# EAGLE design sidedriver (EAGLE 7.1.0)
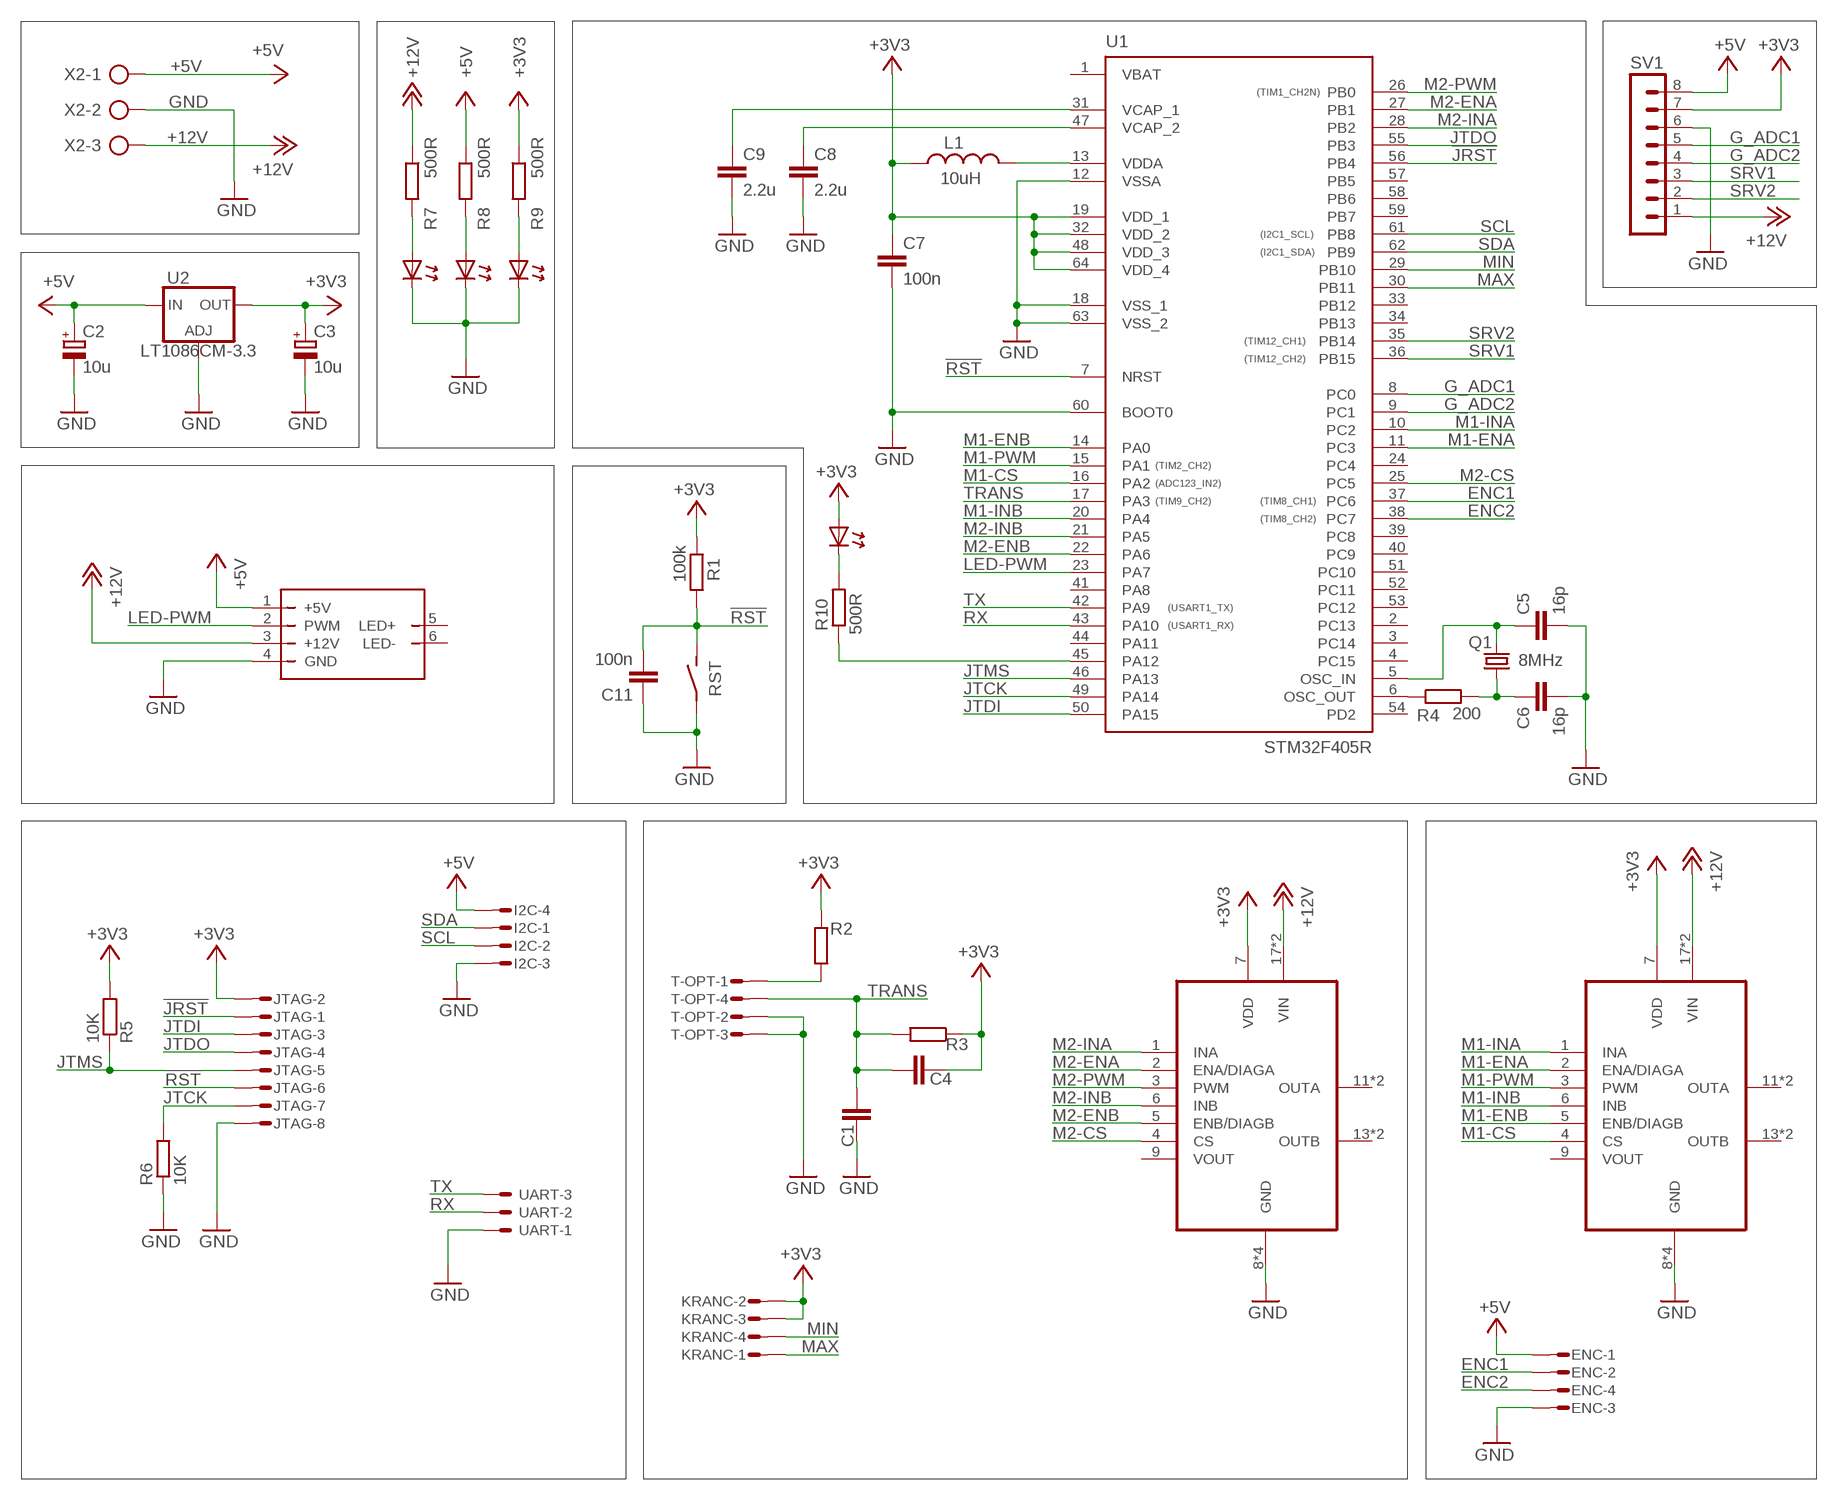
[diagram p0: schematic, sheet 1]

## Parts
C1  C-EUC0603  [C0603]
C2  10u  CPOL-EUSMCA  [SMC_A]
C3  10u  CPOL-EUSMCA  [SMC_A]
C4  C-EUC0603  [C0603]
C5  16p  C-EUC0603  [C0603]
C6  16p  C-EUC0603  [C0603]
C7  100n  C-EUC0603  [C0603]
C8  2.2u  C-EUC0603  [C0603]
C9  2.2u  C-EUC0603  [C0603]
C11  100n  C-EUC0603  [C0603]
ENC  MICROMATCH-4  [MICROMATCH-4]
I2C  MICROMATCH-4  [MICROMATCH-4]
JTAG  MICROMATCH-8  [MICROMATCH-8]
KRANC  MICROMATCH-4  [MICROMATCH-4]
L1  10uH  L  [L0805]
Q1  8MHz  CRYSTAL12SMX  [12SMX]
R1  100k  R-EU_R0603  [R0603]
R2  R-EU_R0603  [R0603]
R3  R-EU_R0603  [R0603]
R4  200  R-EU_R0603  [R0603]
R5  10K  R-EU_R0603  [R0603]
R6  10K  R-EU_R0603  [R0603]
R7  500R  R-EU_R0603  [R0603]
R8  500R  R-EU_R0603  [R0603]
R9  500R  R-EU_R0603  [R0603]
R10  500R  R-EU_R0603  [R0603]
RST  TACT_SWITCH  [SWITCH]
SV1  MA08-1  [MA08-1]
T-OPT  MICROMATCH-4  [MICROMATCH-4]
U1  STM32F405R  [TQFP64]
U2  LT1086CM-3.3  LD117AD2MTR  [D2PACK]
U$2  LEDD1  [LEDD1]
U$3  POLOLU-1451  [POLOLU-1451]
U$4  POLOLU-1451  [POLOLU-1451]
U$6  LED0603  [D0603]
U$7  LED0603  [D0603]
U$8  LED0603  [D0603]
U$9  LED0603  [D0603]
UART  C-GRID-03-70543  [70543-03]
X2  AK500/3  [AK500/3]

## Nets
!JRST: JTAG.1 U1.56(PB4)
!RST: C11.2 JTAG.6 R1.2 RST.2(S) RST.4(S) U1.7(NRST)
+3V3: C3.+ C4.1 C7.1 JTAG.2 KRANC.2 KRANC.3 L1.1 R1.1 R2.1 R3.1 R5.2 R9.1 SV1.7 U1.19(VDD_1) U1.32(VDD_2) U1.48(VDD_3) U1.64(VDD_4) U2.2(OUT) U$3.7(VDD) U$4.7(VDD) U$9.1(A)
+5V: C2.+ ENC.1 I2C.4 R8.1 SV1.8 U2.3(IN) U$2.1(+5V) X2.1
+12V: R7.1 SV1.1 U$2.3(+12V) U$3.17(VIN) U$3.18(VIN) U$4.17(VIN) U$4.18(VIN) X2.3
ENC1: ENC.2 U1.37(PC6)
ENC2: ENC.4 U1.38(PC7)
G_ADC1: SV1.5 U1.8(PC0)
G_ADC2: SV1.4 U1.9(PC1)
GND: C1.1 C2.- C3.- C5.2 C6.2 C7.2 C8.2 C9.2 C11.1 ENC.3 I2C.3 JTAG.8 R6.1 RST.1(P) RST.3(P) SV1.6 T-OPT.2 T-OPT.3 U1.12(VSSA) U1.18(VSS_1) U1.60(BOOT0) U1.63(VSS_2) U2.1(ADJ) U$2.4(GND) U$3.8(GND) U$3.10(GND) U$3.15(GND) U$3.16(GND) U$4.8(GND) U$4.10(GND) U$4.15(GND) U$4.16(GND) U$6.2(C) U$7.2(C) U$8.2(C) UART.1 X2.2
JTCK: JTAG.7 R6.2 U1.49(PA14)
JTDI: JTAG.3 U1.50(PA15)
JTDO: JTAG.4 U1.55(PB3)
JTMS: JTAG.5 R5.1 U1.46(PA13)
LED-PWM: U1.23(PA7) U$2.2(PWM)
M1-CS: U1.16(PA2) U$4.4(CS)
M1-ENA: U1.11(PC3) U$4.2(ENA/DIAGA)
M1-ENB: U1.14(PA0) U$4.5(ENB/DIAGB)
M1-INA: U1.10(PC2) U$4.1(INA)
M1-INB: U1.20(PA4) U$4.6(INB)
M1-PWM: U1.15(PA1) U$4.3(PWM)
M2-CS: U1.25(PC5) U$3.4(CS)
M2-ENA: U1.27(PB1) U$3.2(ENA/DIAGA)
M2-ENB: U1.22(PA6) U$3.5(ENB/DIAGB)
M2-INA: U1.28(PB2) U$3.1(INA)
M2-INB: U1.21(PA5) U$3.6(INB)
M2-PWM: U1.26(PB0) U$3.3(PWM)
MAX: KRANC.1 U1.30(PB11)
MIN: KRANC.4 U1.29(PB10)
N$1: R2.2 T-OPT.1
N$4: C6.1 Q1.1 R4.2
N$5: C5.1 Q1.3 U1.5(OSC_IN)
N$8: R7.2 U$6.1(A)
N$9: R8.2 U$7.1(A)
N$10: R9.2 U$8.1(A)
N$11: R10.2 U$9.2(C)
N$12: R10.1 U1.45(PA12)
N$20: L1.2 U1.13(VDDA)
N$22: R4.1 U1.6(OSC_OUT)
N$23: C8.1 U1.47(VCAP_2)
N$24: C9.1 U1.31(VCAP_1)
RX: U1.43(PA10) UART.2
SCL: I2C.2 U1.61(PB8)
SDA: I2C.1 U1.62(PB9)
SRV1: SV1.3 U1.36(PB15)
SRV2: SV1.2 U1.35(PB14)
TRANS: C1.2 C4.2 R3.2 T-OPT.4 U1.17(PA3)
TX: U1.42(PA9) UART.3
Unconnected: U1.1(VBAT) U1.2(PC13) U1.3(PC14) U1.4(PC15) U1.24(PC4) U1.33(PB12) U1.34(PB13) U1.39(PC8) U1.40(PC9) U1.41(PA8) U1.44(PA11) U1.51(PC10) U1.52(PC11) U1.53(PC12) U1.54(PD2) U1.57(PB5) U1.58(PB6) U1.59(PB7) U$2.5(LED+) U$2.6(LED-) U$3.9(VOUT) U$3.11(OUTA) U$3.12(OUTA) U$3.13(OUTB) U$3.14(OUTB) U$4.9(VOUT) U$4.11(OUTA) U$4.12(OUTA) U$4.13(OUTB) U$4.14(OUTB)

## Notes on the sheet
- (TIM1_CH2N)
- (I2C1_SCL)
- (I2C1_SDA)
- (TIM12_CH1)
- (TIM12_CH2)
- (TIM2_CH2)
- (ADC123_IN2)
- (TIM9_CH2) | (TIM8_CH1)
- (TIM8_CH2)
- (USART1_TX)
- (USART1_RX)

## Library data of the parts
C1 C4-C9 C11 = rcl:C-EU: CAPACITOR, European symbol
C2 C3 = rcl:CPOL-EU: POLARIZED CAPACITOR, European symbol
ENC I2C KRANC T-OPT = con-maritex:MICROMATCH-4: MicroMaTch 4 7-215464-4 / 0-215464-4 Drawing Number C-215464 DDEController.pdf
JTAG = con-maritex:MICROMATCH-8: MicroMaTch 8 7-215464-8 / 0-215464-8 Drawing Number C-215464 DDEController.pdf
L1 = con-maritex:L
Q1 = wb:CRYSTAL: CRYSTAL
R1-R10 = rcl:R-EU_: RESISTOR, European symbol
RST = wb_2:TACT_SWITCH
SV1 = con-lstb:MA08-1: PIN HEADER; OC_FARNELL: unknown; OC_NEWARK: unknown
U1 = stm32f4:STM32F405R: STM32F405 64 pin LQFP reviewed: YES tested: YES
U2 = v-reg:LD117A?*: Low drop fixed and adjustable positive voltage regulators 1 A Source: http://www.st.com/stonline/products/literature/ds/7194/ld1117axx.pdf
U$2 = ledd1:LEDD1
U$3 U$4 = pololu:POLOLU-1451
U$6-U$9 = wb:LED0603
UART = con-molex:C-GRID-03: CONNECTOR wire to board 2.54 mm (0.100") pitch header; OC_FARNELL: unknown; OC_NEWARK: unknown
X2 = con-ptr500:AK500/3: CONNECTOR; OC_FARNELL: unknown; OC_NEWARK: unknown

## Board
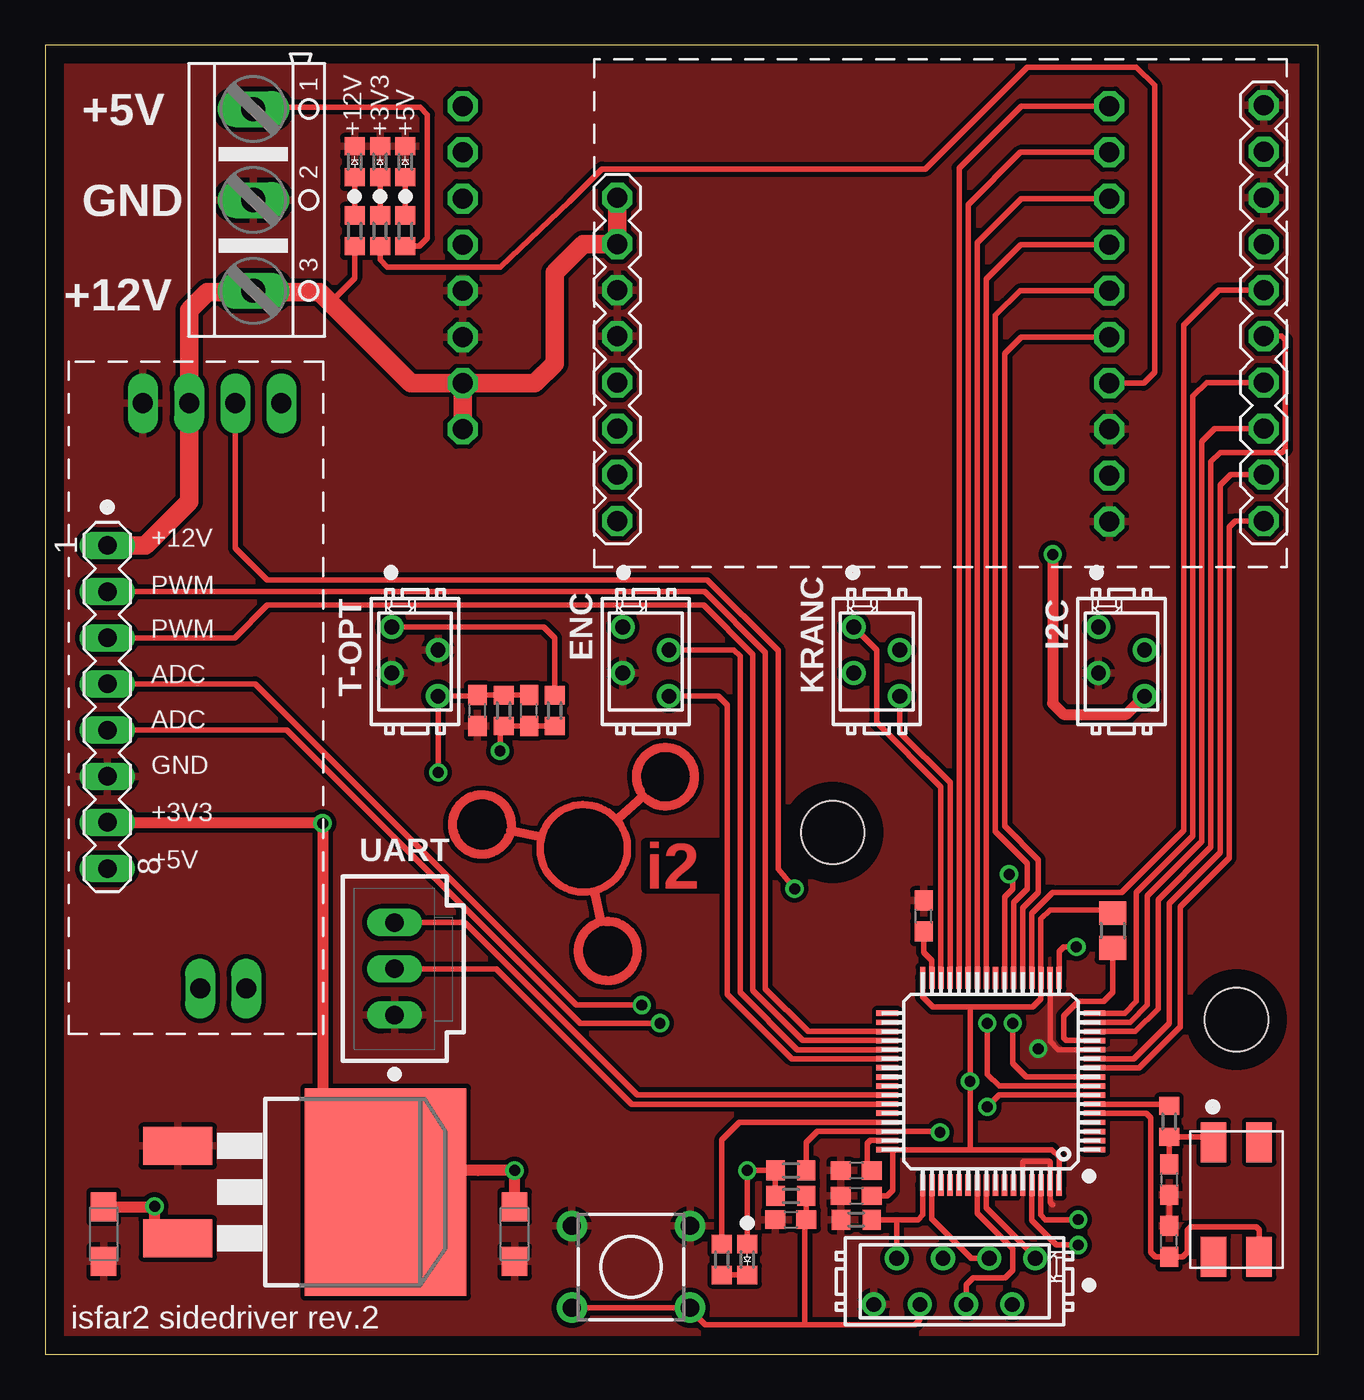
[diagram p1: board, top side]
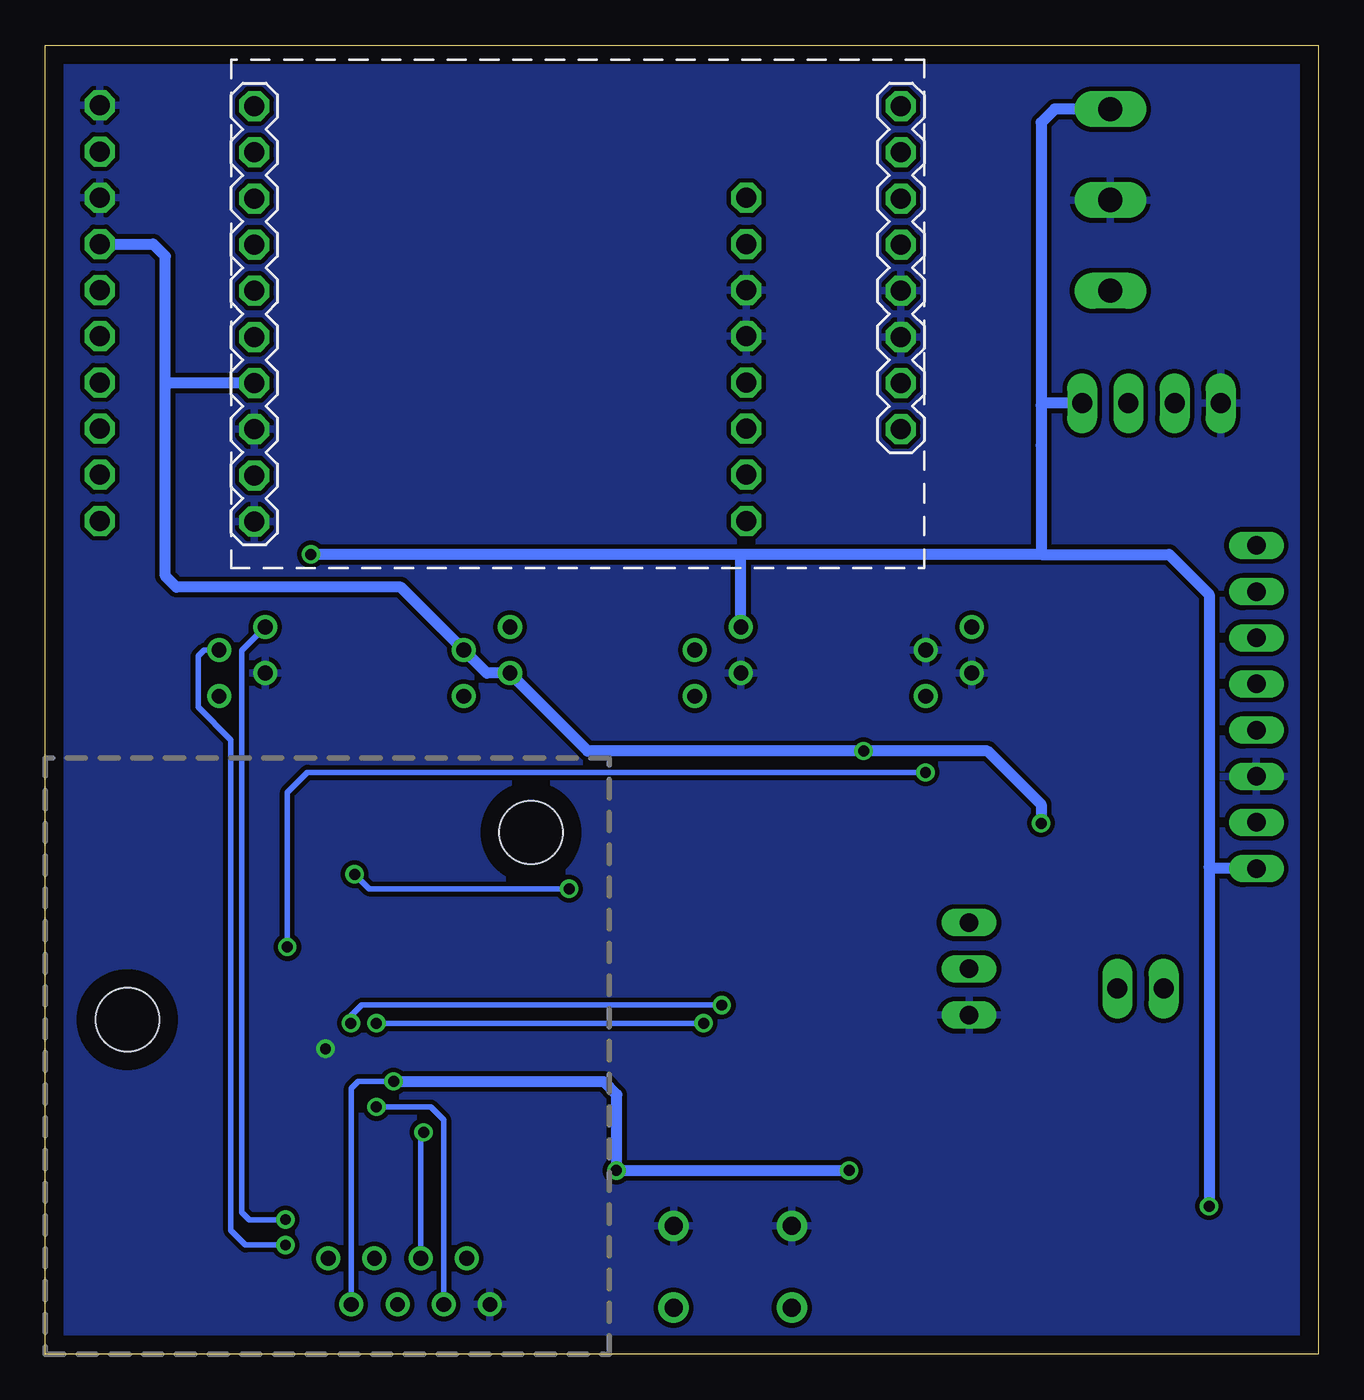
[diagram p2: board, bottom side, seen from below]

Size 70 x 72 mm. Coordinates in mm from the lower left corner, seen from the top.
Outline: 0,0 70,0 70,72 0,72 0,0
Copper layers (1*16): Top 0.035mm / dielectric 1.5mm / Bottom 0.035mm
Design rules "default *": minimum track width 10mil, minimum drill 0.5mm, track to track 6mil, track to pad 6mil, pad to pad 6mil, via to via 6mil, smd to smd 6mil, copper to edge 40mil, drill to drill 8mil, minimum pad ring 10mil, minimum via ring 8mil, stop-mask expansion 4mil, vias tented up to drill 0mil, thermal gap 10mil
Holes 3.5 mm at 65.5,18.4 43.3,28.7

### Footprints (pad centres in the part's own frame; a part is rotated, then mirrored left to right if it is on the bottom)
C0603 = smd 1.1 x 1: 1 -0.85,0; 2 0.85,0
SMC_A = smd 1.6 x 1.4: + -1.5,0; - 1.5,0
MICROMATCH-4 = drill 0.813: 1 1.905,1.27; 2 0.635,-1.27; 3 -0.635,1.27; 4 -1.905,-1.27
MICROMATCH-8 = drill 0.813: 1 4.445,1.27; 2 3.175,-1.27; 3 1.905,1.27; 4 0.635,-1.27; 5 -0.635,1.27; 6 -1.905,-1.27; 7 -3.175,1.27; 8 -4.445,-1.27
L0805 = smd 1.3 x 1.5: 1 -0.95,0; 2 0.95,0
12SMX = smd 2.2 x 1.4: 1 -3.15,-1.25; 2 -3.15,1.25; 3 3.15,1.25; 4 3.15,-1.25
R0603 = smd 1 x 1.1: 1 -0.85,0; 2 0.85,0
SWITCH = drill 1 pad 1.676: 1 -2.25,3.25; 2 2.25,3.25; 3 -2.25,-3.25; 4 2.25,-3.25
MA08-1 = drill 1.016 long: 1 -8.89,0; 2 -6.35,0; 3 -3.81,0; 4 -1.27,0; 5 1.27,0; 6 3.81,0; 7 6.35,0; 8 8.89,0
TQFP64 = smd 1.2 x 0.3: 1 -5.7,3.75; 2 -5.7,3.25; 3 -5.7,2.75; 4 -5.7,2.25; 5 -5.7,1.75; 6 -5.7,1.25; 7 -5.7,0.75; 8 -5.7,0.25; 9 -5.7,-0.25; 10 -5.7,-0.75; 11 -5.7,-1.25; 12 -5.7,-1.75; 13 -5.7,-2.25; 14 -5.7,-2.75; 15 -5.7,-3.25; 16 -5.7,-3.75; 33 5.7,-3.75; 34 5.7,-3.25; 35 5.7,-2.75; 36 5.7,-2.25; 37 5.7,-1.75; 38 5.7,-1.25; 39 5.7,-0.75; 40 5.7,-0.25; 41 5.7,0.25; 42 5.7,0.75; 43 5.7,1.25; 44 5.7,1.75; 45 5.7,2.25; 46 5.7,2.75; 47 5.7,3.25; 48 5.7,3.75 | smd 0.3 x 1.2: 17 -3.75,-5.7; 18 -3.25,-5.7; 19 -2.75,-5.7; 20 -2.25,-5.7; 21 -1.75,-5.7; 22 -1.25,-5.7; 23 -0.75,-5.7; 24 -0.25,-5.7; 25 0.25,-5.7; 26 0.75,-5.7; 27 1.25,-5.7; 28 1.75,-5.7; 29 2.25,-5.7; 30 2.75,-5.7; 31 3.25,-5.7; 32 3.75,-5.7; 49 3.75,5.7; 50 3.25,5.7; 51 2.75,5.7; 52 2.25,5.7; 53 1.75,5.7; 54 1.25,5.7; 55 0.75,5.7; 56 0.25,5.7; 57 -0.25,5.7; 58 -0.75,5.7; 59 -1.25,5.7; 60 -1.75,5.7; 61 -2.25,5.7; 62 -2.75,5.7; 63 -3.25,5.7; 64 -3.75,5.7
D2PACK = smd 2.083 x 3.81: 1 -2.54,-8.89; 3 2.54,-8.89 | smd 11.43 x 8.89: 2 0,2.54
LEDD1 = drill 1.1 long: 1 2.3,11.71; 2 2.3,9.17; 3 2.3,6.63; 4 2.3,4.09; 5 34.5,9.77; 6 34.5,7.23
POLOLU-1451 = drill 1.1 octagon: 1 -16.51,10.16; 2 -16.51,7.62; 3 -16.51,5.08; 4 -16.51,2.54; 5 -16.51,0; 6 -16.51,-2.54; 7 -16.51,-5.08; 8 -16.51,-7.62; 9 -16.51,-10.16; 10 -16.51,-12.7; 11 19.05,10.16; 12 19.05,7.62; 13 19.05,5.08; 14 19.05,2.54; 15 19.05,0; 16 19.05,-2.54; 17 19.05,-5.08; 18 19.05,-7.62
D0603 = smd 1 x 1.1: 1 -0.85,0; 2 0.85,0
70543-03 = drill 1.016 long: 1 -2.54,0; 2 0,0; 3 2.54,0
AK500/3 = drill 1.321 long: 1 -5.004,0; 2 0,0; 3 5.004,0

### Placement (x,y rotation side)
C1  23.76,35.4 90 top
C2  3.2,6.6 270 top
C3  25.8,6.6 270 top
C4  26.6,35.4 90 top
C5  61.8,6.2 90 top
C6  61.8,9.6 270 top
C7  44.6,8.7 180 top
C8  44.6,10.1 180 top
C9  48.3,24.1 90 top
C11  41,7.4 0 top
ENC  33.02,38.1 90 top
I2C  59.18,38.1 90 top
JTAG  50,4 0 top
KRANC  45.72,38.1 90 top
L1  58.7,23.3 270 top
Q1  65.5,8.5 270 top
R1  41,8.7 0 top
R2  28,35.4 90 top
R3  25.2,35.4 90 top
R4  61.8,12.8 270 top
R5  41,10.1 180 top
R6  44.6,7.4 0 top
R7  17,61.8 90 top
R8  19.8,61.8 90 top
R9  18.4,61.8 90 top
R10  37.2,5.2 270 top
RST  32.2,4.8 270 top
SV1  3.4,35.6 270 top
T-OPT  20.32,38.1 90 top
U1  52,15 180 top
U2  16.17,8.91 270 top
U$2  1.27,54.61 270 top
U$3  42,58.5 0 bottom
U$4  50.5,56 180 top
U$5  [I2-LOGO]  29.8,28.2 0 top
U$6  17,65.6 90 top
U$7  19.8,65.6 90 top
U$8  18.4,65.6 90 top
U$9  38.6,5.2 270 top
UART  19.2,21.2 90 top
X2  11.43,63.5 270 top

### Tracks (layer width: path | path; a pad name or v marks a point on that pad's centre or on a via)
!JRST
  Top 0.305: U1.56 51.75,8.05 54.45,5.36 JTAG.1
!RST  (via drill 0.6)
  Top 0.305: U1.7 52.45,14.25 v51.8,13.6 | RST.4 35.35,2.55 | RST.2 35.35,2.55 | R1.2 C11.2 | 41.8,7.35 C11.2 | JTAG.6 48.09,1.9 47.8,1.6 41.8,1.6 | 41.8,1.6 36.3,1.6 35.35,2.55 | C11.2 41.75,7.3 41.75,1.65 41.8,1.6
  Bottom 0.305: v51.8,13.6 48.8,13.6 48.09,12.89 JTAG.6
+3V3  (via drill 0.6)
  Top 0.305: U1.48 46.6,11.25 | 46.6,11.25 46.6,9 46.3,8.7 C7.1 | U1.32 48.25,19.65 48.8,19.1 50.8,19.1 | 50.8,19.1 54.3,19.1 54.75,19.55 U1.19 54.75,23.95 55.25,24.45 58.7,24.45 L1.1 | 50.8,19.1 50.85,19.05 v50.85,15 50.85,11.3 50.8,11.25 | 23.82,10.08 23.8,10.1 | 17.72,10.1 U2.2 | R1.1 R5.2 v38.6,10.1 U$9.1 38.6,5.85 | R9.1 18.4,60.2 18.8,59.8 25,59.8 28.8,63.4 30.6,65.2 48.4,65.2 54,70.8 60,70.8 61,69.8 61,54.02 60.4,53.42 U$3.7 | 46.6,11.25 50.8,11.25 | 50.8,11.25 55.35,11.25 55.75,10.85 U1.64 | R2.1 C4.1 R3.1 25,34.35 v25,33.18 | 15.24,29.25 v15.24,29.2
  Top 0.61: C3.+ v25.8,10.1 23.8,10.1 17.72,10.1 15.24,12.58 v15.24,29.2 | SV1.7 15.24,29.25
  Bottom 0.305: JTAG.2 53.17,14.62 52.8,15 v50.85,15
  Bottom 0.61: 44.47,37.47 45.72,37.47 KRANC.2 50.45,42.2 62.8,42.2 63.4,42.8 63.4,53.4 | U$3.7 63.18,53.42 63.4,53.4 | U$4.7 64.08,61.08 63.4,60.4 63.4,53.4 | 38.58,10.1 38.58,14.28 39.3,15 v50.85,15 | v38.6,10.1 38.58,10.1 | 44.47,37.47 40.18,33.18 v25,33.18 18.18,33.18 15.24,30.24 v15.24,29.2 | KRANC.3 44.47,37.47 | 38.58,10.1 v25.8,10.1
+5V  (via drill 0.6)
  Top 0.305: R8.1 20.55,60.95 21,61.4 21,68.2 20.6,68.6 11.53,68.6 X2.1
  Top 0.61: v55.4,44 55.4,35.8 56,35.2 59.46,35.2 I2C.4 | U2.3 6,6.37 v6,8.13 6,8.2 5.9,8.1 C2.+
  Bottom 0.305: 31.75,43.95 31.8,44
  Bottom 0.61: X2.1 14.5,68.5 15.24,67.76 15.24,52.2 | 15.24,52.2 15.24,49.99 15.23,44 | 15.23,44 31.8,44 v55.4,44 | ENC.1 31.75,43.95 | U$2.1 15.13,52.31 15.24,52.2 | 15.23,44 8.2,44 6,41.8 6,26.8 | 6,26.8 v6,8.13 | SV1.8 5.91,26.71 6,26.8
+12V
  Top 0.305: R7.1 17,59.2 15.65,57.85
  Top 0.813: 11.35,58.42 X2.3 11.51,58.42
  Top 1.016: U$4.18 U$4.17 29.58,61.08 28,59.5 28,54.5 26.92,53.42 U$3.17 | 11.35,58.42 8.89,58.42 7.9,57.43 U$2.3 7.9,46.9 5.49,44.49 SV1.1 | U$3.18 U$3.17 | 11.51,58.42 15.08,58.42 15.65,57.85 20.08,53.42 U$3.17
ENC1
  Top 0.305: U1.37 41.35,16.75 38.2,19.9 38.2,38.4 37.87,38.73 ENC.2
ENC2
  Top 0.305: U1.38 41.05,16.25 37.5,19.8 37.5,35.7 37.01,36.2 ENC.4
G_ADC1  (via drill 0.6)
  Top 0.305: U1.8 52.45,14.75 51.8,15.4 v51.8,18.2 | v33.8,18.2 29.4,18.2 13.27,34.33 SV1.5
  Bottom 0.305: v51.8,18.2 v33.8,18.2
G_ADC2  (via drill 0.6)
  Top 0.305: U1.9 53.95,15.25 53.2,16 v53.2,18.2 | v32.8,19.2 29.2,19.2 11.53,36.87 SV1.4
  Bottom 0.305: v53.2,18.2 53.2,18.6 52.6,19.2 v32.8,19.2
GND  (via drill 0.6)
  Top 0.305: C6.2 C5.2 | U1.60 53.75,10.55 53.8,10.6 55.2,10.6 55.25,10.55 U1.63 55.25,8.35 55.4,8.2 | U1.18 55.25,17.2 55.7,16.75 U1.12
  other vias: 54.6,16.8
  pour Top (isolate 0.254): 0,0 70,0 70,72 0,72
  pour Bottom (isolate 0.254): 0,0 70,0 70,72 0,72
JTCK
  Top 0.305: U1.49 48.25,7.65 48,7.4 46.8,7.4 | JTAG.7 46.83,7.38 46.8,7.4 | R6.2 46.8,7.4
JTDI
  Top 0.305: U1.50 48.75,7.45 50.93,5.27 JTAG.3
JTDO
  Top 0.305: JTAG.4 50.63,3.8 51.03,4.2 52.8,4.2 53.2,4.6 53.2,5.8 51.25,7.75 U1.55
JTMS  (via drill 0.6)
  Top 0.305: v49.2,12.2 49.15,12.25 U1.46 42.45,12.25 41.85,11.65 R5.1
  Bottom 0.305: JTAG.5 49.37,12.04 v49.2,12.2
LED-PWM  (via drill 0.6)
  Top 0.305: U1.23 52.75,25.15 53.2,25.6 53.2,26.2 v53,26.4 | U$2.2 10.44,44.36 12.2,42.6 36.4,42.6 40.3,38.7 40.3,26.7 v41.2,25.6
  Bottom 0.305: v53,26.4 52.2,25.6 v41.2,25.6
M1-CS
  Top 0.305: U1.16 59.35,18.75 60,19.4 60,25.4 63.1,28.5 63.1,52.7 63.86,53.46 U$4.4
M1-ENA
  Top 0.305: U1.11 59.85,16.25 61.8,18.2 61.8,24.8 64.6,27.6 64.6,47.8 65.18,48.38 U$4.2
M1-ENB
  Top 0.305: U1.14 59.95,17.75 61.2,19 61.2,25 64.1,27.9 64.1,49.1 64.6,49.6 68,49.6 68.2,49.8 68.2,55.8 68,56 U$4.5
M1-INA
  Top 0.305: U1.10 60.15,15.75 62.4,18 62.4,24.6 65.1,27.3 65.1,45.5 65.44,45.84 U$4.1
M1-INB
  Top 0.305: U$4.6 64.54,58.54 62.6,56.6 62.6,28.8 59.2,25.4 55.4,25.4 54.25,24.25 U1.20
M1-PWM
  Top 0.305: U1.15 59.65,18.25 60.6,19.2 60.6,25.2 63.6,28.2 63.6,50.2 64.32,50.92 U$4.3
M2-CS
  Top 0.305: U$3.4 53.64,61.04 51.75,59.15 U1.25
M2-ENA
  Top 0.305: U$3.2 53.62,66.12 50.75,63.25 U1.27
M2-ENB
  Top 0.305: U$3.5 53.6,58.5 52.25,57.15 52.25,28.75 54,27 54,25.6 53.25,24.85 U1.22
M2-INA
  Top 0.305: U$3.1 53.66,68.66 50.25,65.25 U1.28
M2-INB
  Top 0.305: U$3.6 53.66,55.96 52.75,55.05 52.75,29.05 54.6,27.2 54.6,25.4 53.75,24.55 U1.21
M2-PWM
  Top 0.305: U$3.3 53.68,63.58 51.25,61.15 U1.26
MAX
  Top 0.305: KRANC.1 45.72,38.73 45.72,34.74 49.25,31.21 U1.30
MIN
  Top 0.305: KRANC.4 46.99,34.21 49.75,31.45 U1.29
N$1
  Top 0.305: R2.2 28,39.4 27.39,40.01 T-OPT.1
N$4
  Top 0.305: C6.1 R4.2 63.95,11.95 Q1.1
N$5
  Top 0.305: U1.5 60.55,13.25 60.8,13 60.8,5.6 61.05,5.35 C5.1 62.55,5.35 62.8,5.6 62.8,6.8 63,7 66.6,7 66.75,6.85 Q1.3
N$8
  Top 0.305: U$6.1 R7.2
N$9
  Top 0.305: U$7.1 R8.2
N$10
  Top 0.305: U$8.1 R9.2
N$11
  Top 0.305: R10.2 U$9.2
N$12
  Top 0.305: U1.45 38.15,12.75 37.2,11.8 R10.1
N$20
  Top 0.305: U1.13 56.15,17.25 56,17.4 56,18.6 56.8,19.4 58.2,19.4 58.7,19.9 L1.2
N$22
  Top 0.305: U1.6 61.7,13.75 R4.1
N$23
  Top 0.305: U1.47 45.35,11.75 45.2,11.6 45.2,9.85 C8.1
N$24
  Top 0.305: U1.31 48.75,21.65 48.3,22.1 C9.1
RX
  Top 0.305: U1.43 32.25,13.75 24.8,21.2 UART.2
SCL  (via drill 0.6)
  Top 0.305: U1.61 54.25,7.35 55.6,6 v56.8,6
  Bottom 0.305: I2C.2 61.27,38.73 61.6,38.4 61.6,35.6 59.8,33.8 59.8,6.8 59,6 v56.8,6
SDA  (via drill 0.6)
  Top 0.305: U1.62 54.75,7.65 55,7.4 v56.8,7.4
  Bottom 0.305: I2C.1 59.2,38.72 59.2,7.8 58.8,7.4 v56.8,7.4
SRV1
  Top 0.305: U1.36 41.65,17.25 38.9,20 38.9,38.5 36.2,41.2 12.2,41.2 10.41,39.41 SV1.3
SRV2
  Top 0.305: U1.35 41.95,17.75 39.6,20.1 39.6,38.6 36.25,41.95 SV1.2
TRANS  (via drill 0.6)
  Top 0.305: U1.17 55.75,22.15 56,22.4 v56.7,22.4 | v21.6,32 21.6,36.19 T-OPT.4 23.7,36.2 C1.2 R3.2 C4.2
  Bottom 0.305: v56.7,22.4 56.7,30.9 55.6,32 v21.6,32
TX
  Top 0.305: U1.42 32.55,14.25 23.06,23.74 UART.3

### Text on the board
tNames: +5V | +12V | +3V3 | +5V | GND | +12V | +12V | PWM | PWM | ADC | ADC | GND | +3V3 | +5V | isfar2 sidedriver rev.2